# Altium schematic sheet Encoder_3.SchDoc
size A4
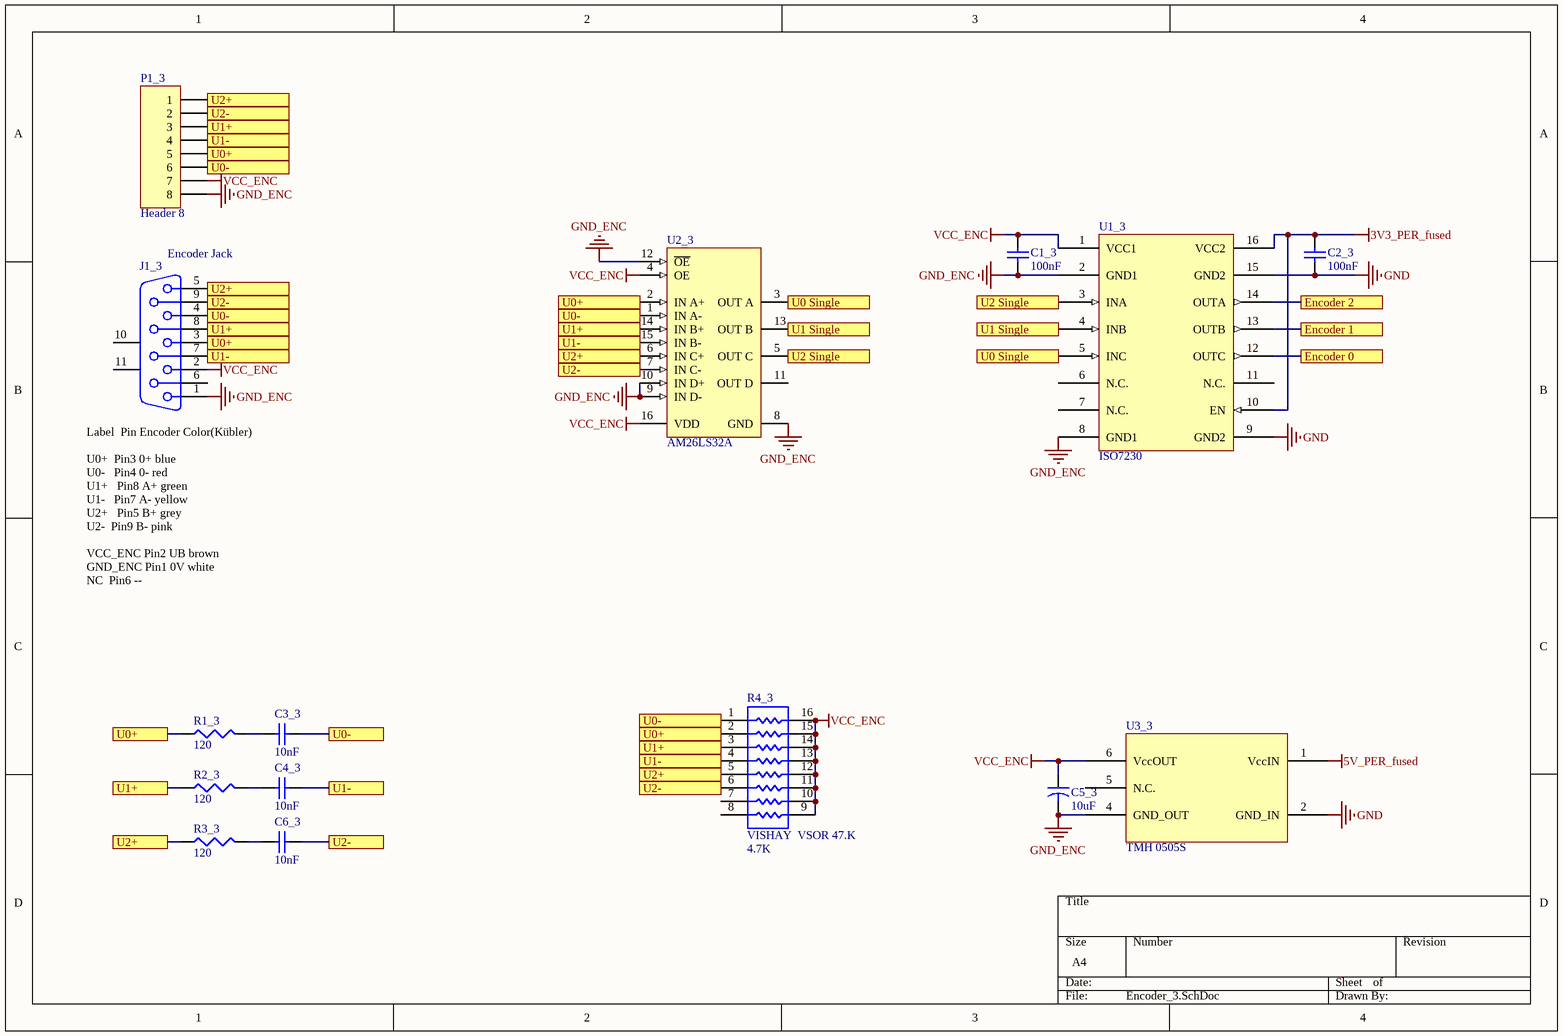
[diagram p0: Encoder_3.SchDoc]

## Parts
C1_3  100nF  [RESC0805]
C2_3  100nF  [RESC0805]
C3_3  10nF  [RESC0805]
C4_3  10nF  [RESC0805]
C5_3  10uF  [CAPR5-4X5]
C6_3  10nF  [RESC0805]
J1_3  Encoder Jack  [DSUB1.385-2H9]
P1_3  Header 8  [HDR1X8]
R1_3  120  [RESC0805]
R2_3  120  [RESC0805]
R3_3  120  [RESC0805]
R4_3  VISHAY  VSOR 47.K  value 4.7K  [SO-16_N]
U1_3  ISO7230  [TI ISO7230 SOIC]
U2_3  AM26LS32A  [M16A_N]
U3_3  TMH 0505S  [SIL-6(7)]

## Ports
Encoder 0, Encoder 1, Encoder 2, U0 Single, U0+, U0-, U1 Single, U1+, U1-, U2 Single, U2+, U2-

## Nets
3V3_PER_fused: C2_3.2 U1_3.10(EN) U1_3.16(VCC2)
5V_PER_fused: U3_3.1(VccIN)
GND: C2_3.1 U1_3.9(GND2) U1_3.15(GND2) U3_3.2(GND_IN)
GND_ENC: C1_3.1 C5_3.2 J1_3.1 P1_3.8 U1_3.2(GND1) U1_3.8(GND1) U2_3.8(GND) U2_3.9(IN_D-) U2_3.10(IN_D+) U2_3.12(~{OE}) U3_3.4(GND_OUT)
VCC_ENC: C1_3.2 C5_3.1 J1_3.2 P1_3.7 R4_3.9 R4_3.10 R4_3.11 R4_3.12 R4_3.13 R4_3.14 R4_3.15 R4_3.16 U1_3.1(VCC1) U2_3.4(OE) U2_3.16(VDD) U3_3.6(VccOUT)
Encoder 0: U1_3.12(OUTC) ; port Encoder 0
Encoder 1: U1_3.13(OUTB) ; port Encoder 1
Encoder 2: U1_3.14(OUTA) ; port Encoder 2
U0 Single: U1_3.5(INC) U2_3.3(OUT_A) ; port U0 Single
U0+: J1_3.3 P1_3.5 R1_3.1 R4_3.2 U2_3.2(IN_A+) ; port U0+
U0-: C3_3.2 J1_3.4 P1_3.6 R4_3.1 U2_3.1(IN_A-) ; port U0-
U1 Single: U1_3.4(INB) U2_3.13(OUT_B) ; port U1 Single
U1+: J1_3.8 P1_3.3 R2_3.1 R4_3.3 U2_3.14(IN_B+) ; port U1+
U1-: C4_3.2 J1_3.7 P1_3.4 R4_3.4 U2_3.15(IN_B-) ; port U1-
U2 Single: U1_3.3(INA) U2_3.5(OUT_C) ; port U2 Single
U2+: J1_3.5 P1_3.1 R3_3.1 R4_3.5 U2_3.6(IN_C+) ; port U2+
U2-: C6_3.2 J1_3.9 P1_3.2 R4_3.6 U2_3.7(IN_C-) ; port U2-
NetC3_3_1: C3_3.1 R1_3.2
NetC4_3_1: C4_3.1 R2_3.2
NetC6_3_1: C6_3.1 R3_3.2

Not connected (* = marked no-connect by the designer): J1_3 6 10(MH1) 11(MH2); R4_3 7 8; U1_3 6(N.C.) 7(N.C.) 11(N.C.); U2_3 11(OUT_D); U3_3 5(N.C.)

## Notes on the sheet
- (near J1_3) Label		Pin	Encoder	Color(Kübler)
  U0+		Pin3	0+	blue
  U0- 		Pin4	0-	red
  U1+ 		Pin8	A+	green
  U1- 		Pin7	A-	yellow
  U2+ 		Pin5	B+	grey
  U2-		Pin9	B-	pink
  VCC_ENC	Pin2	UB	brown
  GND_ENC	Pin1	0V	white
  NC		Pin6	--

## Library data of the parts
C1_3 C2_3 C3_3 C4_3 C6_3 = Cap: Capacitor; Published: 8-Jun-2000; LatestRevisionDate: 17-Jul-2002; LatestRevisionNote: Re-released for DXP Platform.; PackageReference: RAD-0.3; Publisher: Altium Limited; PackageDescription: Radial Cap, Thru-Hole; 2 Leads; 0.3 in Pin Spacing
  C1_3 C2_3: Value: 100nF
  C3_3 C4_3 C6_3: Value: 10nF
C5_3 = Cap2: Capacitor; Published: 23-Sep-2002; PackageReference: CAPR5-4X5; Publisher: Altium Limited; PackageDescription: Capacitor; 2 Leads; Value: 10uF
J1_3 = D Connector 9: Receptacle Assembly, 9 Position, Right Angle; PackageDocument: O; Positions: 9; Published: 15-Jun-2001; LatestRevisionDate: 17-Jul-2002; LatestRevisionNote: Re-released for DXP Platform.; DatasheetDocument: 1-Sep-1999; PackageReference: 788750; Publisher: Altium Limited; Orientation: Right Angle; Gender: Receptacle
P1_3 = Header 8: Header, 8-Pin; LatestRevisionDate: 17-Jul-2002; LatestRevisionNote: Re-released for DXP Platform.; Publisher: Altium Limited
R1_3 R2_3 R3_3 = Resistor: Published: 8-Jun-2000; LatestRevisionDate: 29-May-2009; LatestRevisionNote: IPC-7351 Footprint Added.; PackageReference: J1-0603; Publisher: Altium Limited; PackageDescription: Chip Resistor; Value: 120
R4_3 = Res Pack3: Isolated Resistor Network; Published: 24-Mar-1999; LatestRevisionDate: 29-May-2009; LatestRevisionNote: IPC-7351 Footprint Added.; PackageReference: SO-16; Publisher: Altium Limited; PackageDescription: 16-Pin Small Outline Integrated Circuit 1.27 mm Pitch; Code_JEDEC: MS-012-AC; Code_IPC: SOIC127P600-16
U1_3 = TI ISO7230: High-Speed, Triple-Channel Digital Isolator; Supplier 1: Mouser; Supplier Part Number 1: 595-ISO7230CDWR
U2_3 = DS26LS32CM: Quad Differential Line Receiver, 16-pin Narrow SOIC; PartNumber: AM26LS32AIDR; Manufacturer: TI; CompType: Interface IC; Published: 4-Dec-2008; Supplier 1: Mouser; Supplier Part Number 1: 595-AM26LS32AIDR; PinCount: 16; ComponentLink3Description: M16A Package Page; ComponentLink3URL: http://www.national.com/packaging/folders/m16a.html
U3_3 = TRACO TMH 0505S: 5V/5V DC-DC Isolation Converter